# Altium schematic sheet Sheet1.SchDoc
size A3; SheetNumber: 1; SheetTotal: 1
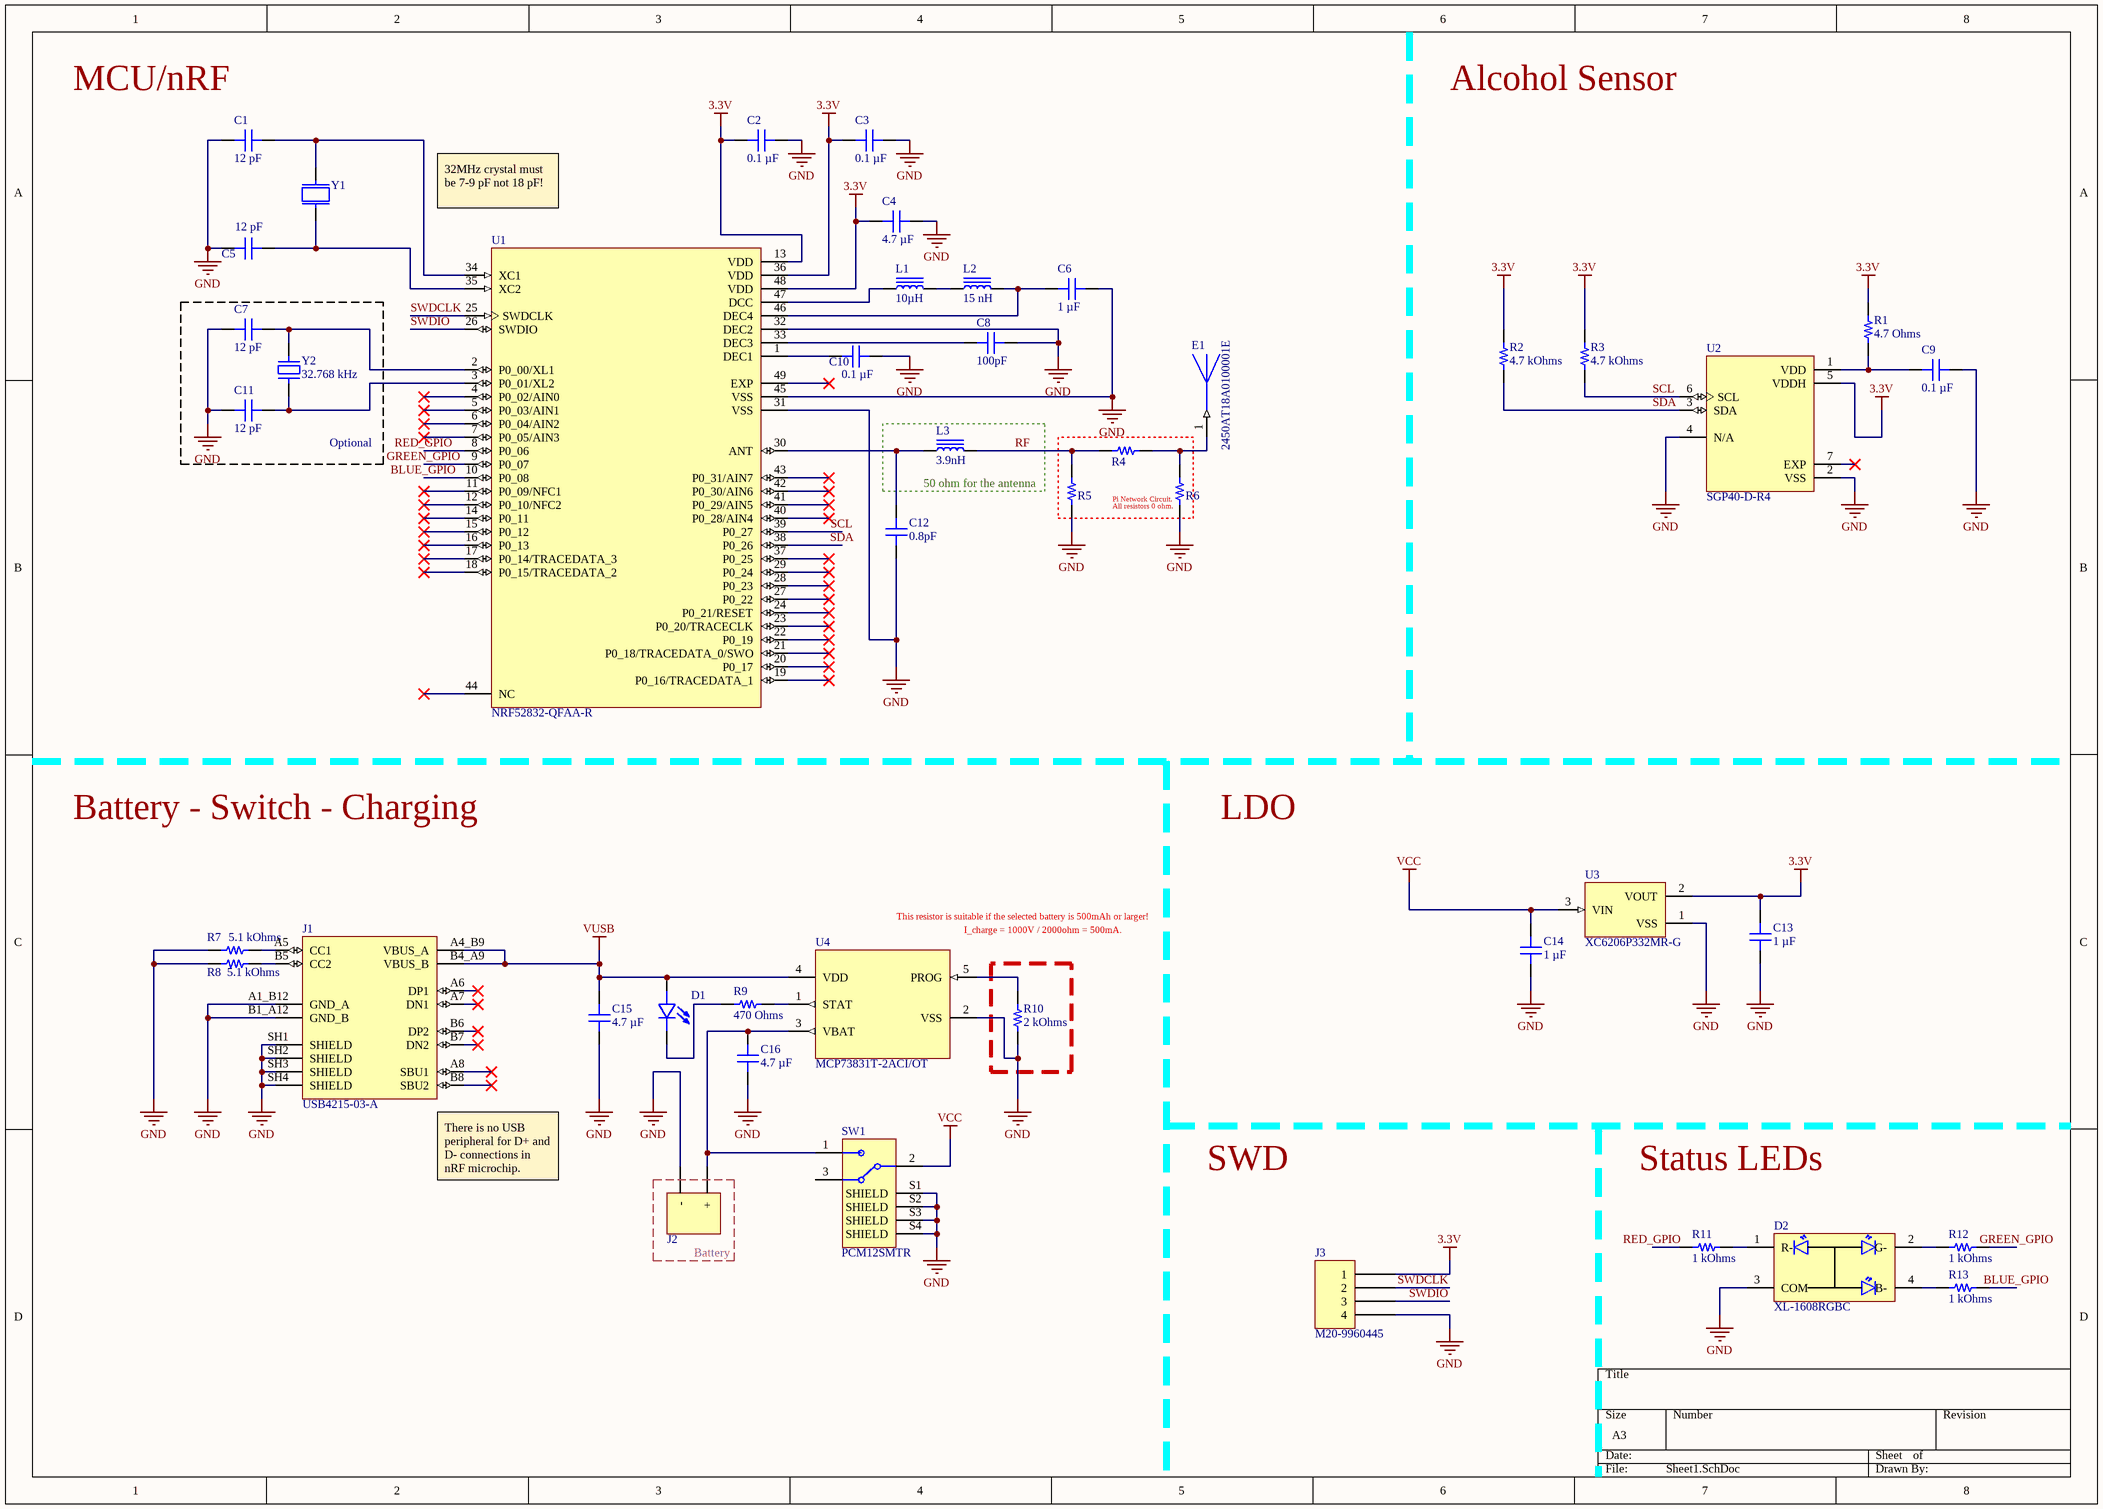
[diagram p0: Sheet1.SchDoc]

## Parts
C1  12 pF  [CAP 0402_1005]
C2  0.1 µF  [CAP 0402_1005]
C3  0.1 µF  [CAP 0402_1005]
C4  4.7 µF  [CAP 0402_1005]
C5  12 pF  [CAP 0402_1005]
C6  1 µF  [CAP 0402_1005]
C7  12 pF  [CAP 0402_1005]
C8  100pF  [CAP 0402_1005]
C9  0.1 µF  [CAP 0402_1005]
C10  0.1 µF  [CAP 0402_1005]
C11  12 pF  [CAP 0402_1005]
C12  0.8pF  [CAP 0402_1005]
C13  1 µF  [CAP 0402_1005]
C14  1 µF  [CAP 0402_1005]
C15  4.7 µF  [CAP 0402_1005]
C16  4.7 µF  [CAP 0402_1005]
D1  XZFBB53W-1  [XZFBB53W-1]  (value not drawn)
D2  XL-1608RGBC  [XL-1608RGBC]
E1  2450AT18A0100001E  [2450AT18A0100001E]
J1  USB4215-03-A  [USB4215-03-A]
J2  Male Header 2 Pin  [Male Header 2 Pin]  (value not drawn)
J3  M20-9960445  [HARWIN M20-9960445]
L1  10µH  [IND 1008_2520]
L2  15 nH  [IND 0201_0603]
L3  3.9nH  [IND 0402_1005]
R1  4.7 Ohms  [RES 0402_1005]
R2  4.7 kOhms  [RES 0402_1005]
R3  4.7 kOhms  [RES 0402_1005]
R4  (no value)  [RES 0402_1005]
R5  (no value)  [RES 0402_1005]
R6  (no value)  [RES 0402_1005]
R7  5.1 kOhms  [RES 0402_1005]
R8  5.1 kOhms  [RES 0402_1005]
R9  470 Ohms  [RES 0402_1005]
R10  2 kOhms  [RES 0402_1005]
R11  1 kOhms  [RES 0402_1005]
R12  1 kOhms  [RES 0402_1005]
R13  1 kOhms  [RES 0402_1005]
SW1  PCM12SMTR  [PCM12SMTR]
U1  NRF52832-QFAA-R  [NRF52832-QFAA-R]
U2  SGP40-D-R4  [SGP40-D-R4]
U3  XC6206P332MR-G  [SOT-23]
U4  MCP73831T-2ACI/OT  [MCP73831T-2ACI/OT]
Y1  XRCGB32M000F2P01R0  [XRCGB32M000F2P01R0]  (value not drawn)
Y2  32.768 kHz  [ABRACON ABS06]

## Blocks framed on the sheet
Optional: C7 C11 Y2
50 ohm for the antenna: L3
Battery: J2

## Nets
3.3V: C2.1 C3.1 C4.1 C13.2 J3.1 R1.2 R2.2 R3.2 U1.13(VDD) U1.36(VDD) U1.48(VDD) U2.5(VDDH) U3.2(VOUT)
GND: C1.1 C2.2 C3.2 C4.2 C5.2 C6.1 C7.1 C8.2 C9.2 C10.1 C11.1 C12.1 C13.1 C14.1 C15.1 C16.1 D2.3(COM) J1.A1_B12(GND_A) J1.B1_A12(GND_B) J1.SH1(SHIELD) J1.SH2(SHIELD) J1.SH3(SHIELD) J1.SH4(SHIELD) J2.01(-) J3.4 R5.2 R6.2 R7.1 R8.1 R10.1 SW1.S1(SHIELD) SW1.S2(SHIELD) SW1.S3(SHIELD) SW1.S4(SHIELD) U1.31(VSS) U1.32(DEC2) U1.45(VSS) U2.2(VSS) U2.4(N/A) U3.1(VSS) U4.2(VSS)
VCC: C14.2 SW1.2 U3.3(VIN)
VUSB: C15.2 D1.A J1.A4_B9(VBUS_A) J1.B4_A9(VBUS_B) U4.4(VDD)
BLUE_GPIO: R13.2 U1.10(P0_08)
GREEN_GPIO: R12.2 U1.9(P0_07)
RED_GPIO: R11.1 U1.8(P0_06)
RF: L3.2 R4.1 R5.1
SCL: R3.1 U1.39(P0_27) U2.6(SCL)
SDA: R2.1 U1.38(P0_26) U2.3(SDA)
SWDCLK: J3.2 U1.25(SWDCLK)
SWDIO: J3.3 U1.26(SWDIO)
NetC1_2: C1.2 U1.34(XC1) Y1.2
NetC5_1: C5.1 U1.35(XC2) Y1.1
NetC6_2: C6.2 L2.2 U1.46(DEC4)
NetC7_2: C7.2 U1.2(P0_00/XL1) Y2.2
NetC8_1: C8.1 U1.33(DEC3)
NetC9_1: C9.1 R1.1 U2.1(VDD)
NetC10_2: C10.2 U1.1(DEC1)
NetC11_2: C11.2 U1.3(P0_01/XL2) Y2.1
NetC12_2: C12.2 L3.1 U1.30(ANT)
NetC16_2: C16.2 J2.02(+) SW1.1 U4.3(VBAT)
NetD1_C: D1.C R9.1
NetD2_1: D2.1(R-) R11.2
NetD2_2: D2.2(G-) R12.1
NetD2_4: D2.4(B-) R13.1
NetE1_1: E1.1 R4.2 R6.1
NetJ1_A5: J1.A5(CC1) R7.2
NetJ1_B5: J1.B5(CC2) R8.2
NetL1_1: L1.1 U1.47(DCC)
NetL1_2: L1.2 L2.1
NetR9_2: R9.2 U4.1(STAT)
NetR10_2: R10.2 U4.5(PROG)

Not connected (* = marked no-connect by the designer): J1 A6(DP1)* A7(DN1)* A8(SBU1)* B6(DP2)* B7(DN2)* B8(SBU2)*; SW1 3; U1 4(P0_02/AIN0)* 5(P0_03/AIN1)* 6(P0_04/AIN2)* 7(P0_05/AIN3)* 11(P0_09/NFC1)* 12(P0_10/NFC2)* 14(P0_11)* 15(P0_12)* 16(P0_13)* 17(P0_14/TRACEDATA_3)* 18(P0_15/TRACEDATA_2)* 19(P0_16/TRACEDATA_1)* 20(P0_17)* 21(P0_18/TRACEDATA_0/SWO)* 22(P0_19)* 23(P0_20/TRACECLK)* 24(P0_21/RESET)* 27(P0_22)* 28(P0_23)* 29(P0_24)* 37(P0_25)* 40(P0_28/AIN4)* 41(P0_29/AIN5)* 42(P0_30/AIN6)* 43(P0_31/AIN7)* 44(NC)* 49(EXP)*; U2 7(EXP)*

## Notes on the sheet
- (near C1) MCU/nRF
- Alcohol Sensor
- 32MHz crystal must be 7-9 pF not 18 pF!
- (near R6) Pi Network Circuit.
- (near R6) All resistors 0 ohm.
- Battery - Switch - Charging
- LDO
- This resistor is suitable if the selected battery is 500mAh or larger!
- I_charge = 1000V / 2000ohm = 500mA.
- (near J1) There is no USB peripheral for D+ and D- connections in nRF microchip.
- SWD
- Status LEDs

## Library data of the parts
C1 C5 = CBR04C120F5GAC: CAP CER 12PF 50V C0G/NP0 0402; manufacturer: KEMET; Temperature Coefficient: C0G, NP0; Tolerance: ±1%; Part Number: CBR04C120F5GAC; Value: 12 pF; Applications: RF, Microwave, High Frequency; Capacitance: 12 pF; componentlink1description: Datasheet; componentlink1url: https://api.kemet.com/component-edge/download/datasheet/CBR04C120F5GAC.pdf; componentlink2description: DigiKey Link; componentlink2url: https://www.digikey.com/en/products/detail/kemet/CBR04C120F5GAC/3479654; Device Package: 0402 (1005 Metric); Features: High Q, Low Loss, Ultra Low ESR; lastupdated: 9.02.2024 20:04:38; Lifecycle Status: Active; Minimum Order: 1; Mounting Type: Surface Mount, MLCC; Operating Temperature: -55°C ~ 125°C; Package / Case: 0402 (1005 Metric); packaging: TapeAndReel; partid: 1750; Part Status: Active; price: 0.06; series: CBR-SMD RF C0G; Size / Dimension: 0.039" L x 0.020" W (1.00mm x 0.50mm); Supplier 1: DigiKey; Supplier Part Number 1: 399-8815-1-ND; Thickness (Max): 0.022" (0.55mm); Voltage - Rated: 50V
C2 C3 C9 C10 = CL05B104KP5VPNC: CAP CER 100NF 10V X7R 0402; manufacturer: Samsung Electro-Mechanics; Tolerance: ±10%; Part Number: CL05B104KP5VPNC; Value: 0.1 µF; Applications: Automotive; Capacitance: 0.1 µF; componentlink1description: Datasheet; componentlink1url: https://mm.digikey.com/Volume0/opasdata/d220001/medias/docus/5458/CL05B104KP5VPNC_Spec.pdf; componentlink2description: DigiKey Link; componentlink2url: https://www.digikey.com/en/products/detail/samsung-electro-mechanics/CL05B104KP5VPNC/20498482; Device Package: 0402 (1005 Metric); lastupdated: 9.02.2024 20:03:17; Lifecycle Status: Active; Minimum Order: 1; Mounting Type: Surface Mount, MLCC; Operating Temperature: -55°C ~ 125°C; Package / Case: 0402 (1005 Metric); packaging: TapeAndReel; partid: 56690; price: 0.01; Ratings: AEC-Q200; series: CL; Size / Dimension: 0.039" L x 0.020" W (1.00mm x 0.50mm); Supplier 1: DigiKey; Supplier Part Number 1: 1276-CL05B104KP5VPNCCT-ND; Temperature Coefficient: X7R; Thickness (Max): 0.022" (0.55mm); Voltage - Rated: 10V
C4 C15 C16 = CL05A475MO5NUNC: CAP CER 4.7UF 16V X5R 0402; manufacturer: Samsung Electro-Mechanics; Tolerance: ±20%; Part Number: CL05A475MO5NUNC; Value: 4.7 µF; Applications: General Purpose; Capacitance: 4.7 µF; componentlink1description: Datasheet; componentlink1url: http://www.samsungsem.com/kr/support/product-search/mlcc/__icsFiles/afieldfile/2019/05/29/Data%20sheet_CL05A475MO5NUNC.pdf; componentlink2description: DigiKey Link; componentlink2url: https://www.digikey.com/en/products/detail/samsung-electro-mechanics/CL05A475MO5NUNC/5961320; Device Package: 0402 (1005 Metric); lastupdated: 9.02.2024 20:04:38; Lifecycle Status: Active; Minimum Order: 1; Mounting Type: Surface Mount, MLCC; Operating Temperature: -55°C ~ 85°C; Package / Case: 0402 (1005 Metric); packaging: TapeAndReel; partid: 1760; Part Status: Active; price: 0.08; series: CL; Size / Dimension: 0.039" L x 0.020" W (1.00mm x 0.50mm); Supplier 1: DigiKey; Supplier Part Number 1: 1276-6836-1-ND; Temperature Coefficient: X5R; Thickness (Max): 0.028" (0.70mm); Voltage - Rated: 16V
C6 C13 C14 = 885012105012: CAP CER 1UF 10V X5R 0402; manufacturer: Würth Elektronik; Tolerance: ±20%; Part Number: 885012105012; Value: 1 µF; Applications: General Purpose; Capacitance: 1 µF; componentlink1description: Datasheet; componentlink1url: https://katalog.we-online.de/pbs/datasheet/885012105012.pdf; componentlink2description: DigiKey Link; componentlink2url: https://www.digikey.com/en/products/detail/würth-elektronik/885012105012/5453344; Device Package: 0402 (1005 Metric); lastupdated: 9.02.2024 20:04:38; Lifecycle Status: Active; Minimum Order: 1; Mounting Type: Surface Mount, MLCC; Operating Temperature: -55°C ~ 85°C; Package / Case: 0402 (1005 Metric); packaging: TapeAndReel; partid: 1807; Part Status: Active; price: 0.16; series: WCAP-CSGP; Size / Dimension: 0.039" L x 0.020" W (1.00mm x 0.50mm); Supplier 1: DigiKey; Supplier Part Number 1: 732-7489-1-ND; Temperature Coefficient: X5R; Thickness (Max): 0.022" (0.55mm); Voltage - Rated: 10V
C7 C11 = C0402C120J3GAC7867: CAP CER 12PF 25V NP0 0402; manufacturer: KEMET; Temperature Coefficient: C0G, NP0; Tolerance: ±5%; Part Number: C0402C120J3GAC7867; Value: 12 pF; Applications: General Purpose; Capacitance: 12 pF; componentlink1description: Datasheet; componentlink1url: https://api.kemet.com/component-edge/download/datasheet/C0402C120J3GACTU.pdf; componentlink2description: DigiKey Link; componentlink2url: https://www.digikey.com/en/products/detail/kemet/C0402C120J3GAC7867/2196267; Device Package: 0402 (1005 Metric); Features: Low ESL; lastupdated: 9.02.2024 20:04:32; Lifecycle Status: Active; Minimum Order: 1; Mounting Type: Surface Mount, MLCC; Operating Temperature: -55°C ~ 125°C; Package / Case: 0402 (1005 Metric); packaging: TapeAndReel; partid: 5422; Part Status: Active; price: 0.04; series: SMD Comm C0G; Size / Dimension: 0.039" L x 0.020" W (1.00mm x 0.50mm); Supplier 1: DigiKey; Supplier Part Number 1: 399-15295-1-ND; Thickness (Max): 0.022" (0.55mm); Voltage - Rated: 25V
C8 = 0402ZC101MAT2A: CAP CER 100PF 10V X7R 0402; manufacturer: AVX Corporation; Tolerance: ±20%; Part Number: 0402ZC101MAT2A; Value: 100pF; Applications: General Purpose; Capacitance: 100pF; componentlink1description: Datasheet; componentlink1url: http://datasheets.avx.com/X7RDielectric.pdf; componentlink2description: DigiKey Link; componentlink2url: http://digikey.com/product-detail/en/avx-corporation/0402ZC101MAT2A/478-11786-1-ND/8573422; Device Package: 0402 (1005 Metric); lastupdated: 8.02.2022 12:26:58; Lifecycle Status: Active; Minimum Order: 1; Mounting Type: Surface Mount, MLCC; Operating Temperature: -55°C ~ 125°C; Package / Case: 0402 (1005 Metric); packaging: TapeAndReel; partid: 1986; Part Status: Active; price: 0.05; series: -; Size / Dimension: 0.039" L x 0.020" W (1.00mm x 0.50mm); Supplier 1: DigiKey; Supplier Part Number 1: 478-11786-1-ND; Temperature Coefficient: X7R; Thickness (Max): 0.022" (0.56mm); Voltage - Rated: 10V
C12 = 04025A0R8BAT2A: CAP CER 0.8PF 50V NP0 0402; manufacturer: AVX Corporation; Temperature Coefficient: C0G, NP0; Tolerance: ±0.1pF; Part Number: 04025A0R8BAT2A; Value: 0.8pF; Applications: General Purpose; Capacitance: 0.8pF; componentlink1description: Datasheet; componentlink1url: http://datasheets.avx.com/C0GNP0-Dielectric.pdf; componentlink2description: DigiKey Link; componentlink2url: http://digikey.com/product-detail/en/avx-corporation/04025A0R8BAT2A/478-11760-1-ND/8573396; Device Package: 0402 (1005 Metric); lastupdated: 8.02.2022 12:26:50; Lifecycle Status: Active; Minimum Order: 1; Mounting Type: Surface Mount, MLCC; Operating Temperature: -55°C ~ 125°C; Package / Case: 0402 (1005 Metric); packaging: TapeAndReel; partid: 7022; Part Status: Active; price: 0.06; series: -; Size / Dimension: 0.039" L x 0.020" W (1.00mm x 0.50mm); Supplier 1: DigiKey; Supplier Part Number 1: 478-11760-1-ND; Thickness (Max): 0.022" (0.55mm); Voltage - Rated: 50V
D1 = XZFBB53W-1: 1.6X0.8MM BLUE SMD 0603 LED
D2 = XL-1608RGBC: Red, Green, Blue (RGB) 625nm Red, 525nm Green, 470nm Blue LED Indication - Discrete 2.1V Red, 3.1V Green, 3.1V Blue 0603 (1608 Metric)
E1 = 2450AT18A0100001E: 2.4GHz Chip RF Antenna 2.4GHz ~ 2.5GHz 0.5dBi Solder Surface Mount
J1 = USB4215-03-A: USB-C (USB TYPE-C) USB 2.0 Receptacle Connector 24 (16+8 Dummy) Position Surface Mount, Right Angle; Through Hole
J3 = M20-9960445: CONN HEADER R/A 4POS 2.54MM; Manufacturer: Harwin Inc.; Connector Type: Header, Cuttable; Contact Length - Mating: 0.240" (6.10mm); Contact Length - Post: 0.118" (3.00mm); Current Rating (Amps): 3A per Contact; Material Flammability Rating: UL94 V-0; Number of Positions: 4; Number of Positions Loaded: All; Pitch - Mating: 0.100" (2.54mm); Row Spacing - Mating: -40°C ~ 105°C; Shrouding: Unshrouded; Style: Board to Board or Cable; Part Number: M20-9960445; ComponentLink1Description: Datasheet; ComponentLink1URL: https://cdn.harwin.com/pdfs/Harwin_PC_Connectors_M20.pdf; ComponentLink2Description: DigiKey Link; ComponentLink2URL: https://www.digikey.com/en/products/detail/harwin-inc/M20-9960445/3921052; Contact Finish - Mating: Gold; Contact Material: Brass; Contact Shape: Square; Contact Type: Male Pin; Fastening Type: Push-Pull; Insulation Color: Black; Insulation Height: 0.100" (2.54mm); Insulation Material: Polyamide (PA6T), Nylon 6T; LastUpdated: 21.09.2022 19:23:20; Lifecycle Status: Active; Minimum Order: 1; Mounting Type: Through Hole, Right Angle; Number of Rows: 1; Operating Temperature: -40°C ~ 105°C; Packaging: Bulk; PartId: 167; Part Status: Active; Price: 0.11; Series: M20; Supplier 1: DigiKey; Supplier Part Number 1: 952-3286-ND; Termination: Solder
L1 = 74479887310A: FIXED IND 10UH 850MA 300 MOHM; Manufacturer: Würth Elektronik; Current - Saturation: 125mA; Frequency - Self Resonant: 20MHz; Inductance Frequency - Test: 1MHz; Material - Core: 1008 (2520 Metric); Q @ Freq: 27 @ 1MHz; Shielding: Shielded; Tolerance: ±20%; Type: Multilayer; Part Number: 74479887310A; ComponentLink1Description: Datasheet; ComponentLink1URL: https://katalog.we-online.de/pbs/datasheet/74479887310A.pdf; ComponentLink2Description: DigiKey Link; ComponentLink2URL: http://digikey.com/product-detail/en/w-rth-elektronik/74479887310A/732-4516-1-ND/4120134; Current Rating (Amps): 850mA; DC Resistance (DCR): 300mOhm; Device Package: 1008 (2520 Metric); Height - Seated (Max): 0.039" (1.00mm); Inductance: 10µH; LastUpdated: 2.09.2020 01:29:35; Lifecycle Status: Active; Minimum Order: 1; Mounting Type: Surface Mount; Operating Temperature: -40°C ~ 125°C; Package / Case: 1008 (2520 Metric); Packaging: TapeAndReel; PartId: 3502; Part Status: Active; Price: 0.80; Series: WE-PMI; Size / Dimension: 0.098" L x 0.079" W (2.50mm x 2.00mm); Supplier 1: DigiKey; Supplier Part Number 1: 732-4516-1-ND; Supplier Device Package: 1008 (2520 Metric); Value: 10µH
L2 = LQP03HQ15NJ02D: FIXED IND 15NH 300MA 700MOHM SMD; Manufacturer: Murata Electronics; DC Resistance (DCR): 700mOhm Max; Frequency - Self Resonant: 3.5GHz; Inductance Frequency - Test: 500 MHz; Material - Core: Non-Magnetic; Q @ Freq: 20 @ 500MHz; Shielding: Unshielded; Tolerance: ±5%; Type: Thick Film; Part Number: LQP03HQ15NJ02D; ComponentLink1Description: Datasheet; ComponentLink1URL: https://search.murata.co.jp/Ceramy/image/img/P02/JELF243C-0021.pdf; ComponentLink2Description: DigiKey Link; ComponentLink2URL: https://www.digikey.com/en/products/detail/murata-electronics/LQP03HQ15NJ02D/6098663; Current Rating (Amps): 300 mA; Device Package: 0201 (0603 Metric); Height - Seated (Max): 0.017" (0.42mm); Inductance: 15 nH; LastUpdated: 3.06.2024 20:08:37; Lifecycle Status: Active; Minimum Order: 1; Mounting Type: Surface Mount; Operating Temperature: -55°C ~ 125°C; Package / Case: 0201 (0603 Metric); Packaging: TapeAndReel; PartId: 492; Part Status: Active; Price: 0.04; Series: LQP03; Size / Dimension: 0.024" L x 0.012" W (0.60mm x 0.30mm); Supplier 1: DigiKey; Supplier Part Number 1: 490-13863-1-ND; Supplier Device Package: 0201 (0603 Metric); Value: 15 nH
L3 = BSCH001005053N9SCP: RF INDUCTOR ML; Manufacturer: Chilisin Electronics; Current Rating (Amps): 400mA; DC Resistance (DCR): 180mOhm Max; Frequency - Self Resonant: 6.1GHz; Inductance Frequency - Test: 100MHz; Material - Core: Ceramic; Q @ Freq: 8 @ 100MHz; Shielding: Unshielded; Tolerance: ±0.3nH; Type: Multilayer; Part Number: BSCH001005053N9SCP; ComponentLink1Description: Datasheet; ComponentLink1URL: https://www.chilisin.com/upload/media/product/rf/file/BSCH_Series.pdf; ComponentLink2Description: DigiKey Link; ComponentLink2URL: http://digikey.com/product-detail/en/chilisin-electronics/BSCH001005053N9SCP/2184-BSCH001005053N9SCPCT-ND/10509199; Device Package: 0402 (1005 Metric); Inductance: 3.9nH; LastUpdated: 3.06.2024 20:13:02; Lifecycle Status: Active; Minimum Order: 1; Mounting Type: Surface Mount; Operating Temperature: -55°C ~ 125°C; Package / Case: 0402 (1005 Metric); Packaging: Unknown; PartId: 3340; Part Status: Active; Price: 0.01; Series: BSCH; Supplier 1: DigiKey; Supplier Part Number 1: 2184-BSCH001005053N9SCPCT-ND; Supplier Device Package: 0402; Value: 3.9nH
R1 = CRCW04024R70JNED: RES SMD 4.7 OHM 5% 1/16W 0402; Manufacturer: Vishay Dale; Power (Watts): 0.063W, 1/16W; Temperature Coefficient: ±200ppm/°C; Part Number: CRCW04024R70JNED; Value: 4.7 Ohms; ComponentLink1Description: Datasheet; ComponentLink1URL: http://www.vishay.com/docs/20035/dcrcwe3.pdf; ComponentLink2Description: DigiKey Link; ComponentLink2URL: https://www.digikey.com/en/products/detail/vishay-dale/CRCW04024R70JNED/1177512; Composition: Thick Film; Device Package: 0402 (1005 Metric); Features: Automotive AEC-Q200; Height - Seated (Max): 0.016" (0.40mm); LastUpdated: 9.02.2024 20:30:14; Lifecycle Status: Active; Minimum Order: 1; Number of Terminations: 2; Operating Temperature: -55°C ~ 155°C; Package / Case: 0402 (1005 Metric); Packaging: CutTape; PartId: 4704; Part Status: Active; Price: 0.01; Ratings: AEC-Q200; Resistance: 4.7 Ohms; Series: CRCW; Size / Dimension: 0.039" L x 0.020" W (1.00mm x 0.50mm); Supplier 1: DigiKey; Supplier Part Number 1: 541-4.7JCT-ND; Supplier Device Package: 0402; Tolerance: ±5%
R2 R3 = RR0510P-472-D: RES SMD 4.7K OHM 0.5% 1/16W 0402; Manufacturer: Susumu; Power (Watts): 0.063W, 1/16W; Temperature Coefficient: ±25ppm/°C; Part Number: RR0510P-472-D; Value: 4.7 kOhms; ComponentLink1Description: Datasheet; ComponentLink1URL: http://www.susumu.co.jp/common/pdf/n_catalog_partition05_en.pdf; ComponentLink2Description: DigiKey Link; ComponentLink2URL: https://www.digikey.com/en/products/detail/susumu/RR0510P-472-D/432413; Composition: Thin Film; Device Package: 0402 (1005 Metric); Height - Seated (Max): 0.016" (0.40mm); LastUpdated: 9.02.2024 20:30:21; Lifecycle Status: Active; Minimum Order: 1; Number of Terminations: 2; Operating Temperature: -55°C ~ 125°C; Package / Case: 0402 (1005 Metric); Packaging: TapeAndReel; PartId: 3209; Part Status: Active; Price: 0.01; Resistance: 4.7 kOhms; Series: RR; Size / Dimension: 0.039" L x 0.020" W (1.00mm x 0.50mm); Supplier 1: DigiKey; Supplier Part Number 1: RR05P4.7KDCT-ND; Tolerance: ±0.5%
R4-R6 = MCS04020Z0000ZE000: RES SMD 0 OHM JUMPER 1/10W 0402; Manufacturer: Vishay Beyschlag; Power (Watts): 0.1W, 1/10W; Part Number: MCS04020Z0000ZE000; ComponentLink1Description: Datasheet; ComponentLink1URL: http://www.vishay.com/docs/28705/mcx0x0xpro.pdf; ComponentLink2Description: DigiKey Link; ComponentLink2URL: http://digikey.com/product-detail/en/vishay-beyschlag/MCS04020Z0000ZE000/MCS0402-0.0-ZZCT-ND/2607873; Composition: Thin Film; Device Package: 0402 (1005 Metric); Features: Anti-Sulfur; Height - Seated (Max): 0.015" (0.37mm); LastUpdated: 14.02.2022 15:04:19; Lifecycle Status: Active; Minimum Order: 1; Number of Terminations: 2; Operating Temperature: -55°C ~ 155°C; Package / Case: 0402 (1005 Metric); Packaging: TapeAndReel; PartId: 3160; Part Status: Active; Price: 0.03; Series: MCS - Professional; Size / Dimension: 0.039" L x 0.020" W (1.00mm x 0.50mm); Supplier 1: DigiKey; Supplier Part Number 1: MCS0402-0.0-ZZCT-ND; Supplier Device Package: 0402; Tolerance: Jumper
R7 R8 = ERA-2AEB512X: RES SMD 5.1K OHM 0.1% 1/16W 0402; Manufacturer: Panasonic Electronic Components; Power (Watts): 0.063W, 1/16W; Temperature Coefficient: ±25ppm/°C; Part Number: ERA-2AEB512X; Value: 5.1 kOhms; ComponentLink1Description: Datasheet; ComponentLink1URL: https://industrial.panasonic.com/cdbs/www-data/pdf/RDM0000/AOA0000C307.pdf; ComponentLink2Description: DigiKey Link; ComponentLink2URL: https://www.digikey.com/en/products/detail/panasonic-electronic-components/ERA-2AEB512X/1706022; Composition: Thin Film; Device Package: 0402 (1005 Metric); Features: Automotive AEC-Q200; Height - Seated (Max): 0.016" (0.40mm); LastUpdated: 9.02.2024 20:30:08; Lifecycle Status: Active; Minimum Order: 1; Number of Terminations: 2; Operating Temperature: -55°C ~ 155°C; Package / Case: 0402 (1005 Metric); Packaging: TapeAndReel; PartId: 6135; Part Status: Active; Price: 0.04; Ratings: AEC-Q200; Resistance: 5.1 kOhms; Series: ERA-2A; Size / Dimension: 0.039" L x 0.020" W (1.00mm x 0.50mm); Supplier 1: DigiKey; Supplier Part Number 1: P5.1KDCCT-ND; Supplier Device Package: 0402; Tolerance: ±0.1%
R9 = TNPW0402470RBYEP: RES 470 OHM 0.1% 1/16W 0402; Manufacturer: Vishay Dale; Power (Watts): 0.1W, 1/10W; Temperature Coefficient: ±10ppm/°C; Part Number: TNPW0402470RBYEP; Value: 470 Ohms; ComponentLink1Description: Datasheet; ComponentLink1URL: http://www.vishay.com/docs/28758/tnpw_e3.pdf; ComponentLink2Description: DigiKey Link; ComponentLink2URL: http://digikey.com/product-detail/en/vishay-dale/TNPW0402470RBYEP/541-9810-1-ND/9562435; Composition: Thin Film; Device Package: 0402 (1005 Metric); Features: Anti-Sulfur, Automotive AEC-Q200, Moisture Resistant; Height - Seated (Max): 0.016" (0.40mm); LastUpdated: 9.02.2024 20:30:21; Lifecycle Status: Active; Minimum Order: 1; Number of Terminations: 2; Operating Temperature: -55°C ~ 155°C; Package / Case: 0402 (1005 Metric); Packaging: TapeAndReel; PartId: 3068; Part Status: Active; Price: 0.27; Ratings: AEC-Q200; Resistance: 470 Ohms; Series: TNPW e3; Size / Dimension: 0.039" L x 0.020" W (1.00mm x 0.50mm); Supplier 1: DigiKey; Supplier Part Number 1: 541-9810-1-ND; Supplier Device Package: 0402; Tolerance: ±0.1%
R10 = CPF0402B2K0E1: RES SMD 2K OHM 0.1% 1/16W 0402; Manufacturer: TE Connectivity Passive Product; Power (Watts): 0.063W, 1/16W; Temperature Coefficient: ±25ppm/°C; Part Number: CPF0402B2K0E1; Value: 2 kOhms; ComponentLink1Description: Datasheet; ComponentLink1URL: https://www.te.com/commerce/DocumentDelivery/DDEController?Action=srchrtrv&DocNm=1773200&DocType=DS&DocLang=English; ComponentLink2Description: DigiKey Link; ComponentLink2URL: https://www.digikey.com/en/products/detail/te-connectivity-passive-product/CPF0402B2K0E1/2381811; Composition: Thin Film; Device Package: 0402 (1005 Metric); Height - Seated (Max): 0.014" (0.35mm); LastUpdated: 9.02.2024 20:30:20; Lifecycle Status: Active; Minimum Order: 1; Number of Terminations: 2; Operating Temperature: -55°C ~ 155°C; Package / Case: 0402 (1005 Metric); Packaging: TapeAndReel; PartId: 3338; Part Status: Active; Price: 0.13; Resistance: 2 kOhms; Series: CPF, Neohm; Size / Dimension: 0.039" L x 0.020" W (1.00mm x 0.50mm); Supplier 1: DigiKey; Supplier Part Number 1: A102762CT-ND; Supplier Device Package: 0402; Tolerance: ±0.1%
R11-R13 = CPF0402B1K0E: RES SMD 1K OHM 0.1% 1/16W 0402; Manufacturer: TE Connectivity Passive Product; Power (Watts): 0.063W, 1/16W; Temperature Coefficient: ±25ppm/°C; Part Number: CPF0402B1K0E; Value: 1 kOhms; ComponentLink1Description: Datasheet; ComponentLink1URL: https://www.te.com/commerce/DocumentDelivery/DDEController?Action=srchrtrv&DocNm=1773200&DocType=DS&DocLang=English; ComponentLink2Description: DigiKey Link; ComponentLink2URL: https://www.digikey.com/en/products/detail/te-connectivity-passive-product/CPF0402B1K0E/4966468; Composition: Thin Film; Device Package: 0402 (1005 Metric); Height - Seated (Max): 0.014" (0.35mm); LastUpdated: 9.02.2024 20:30:24; Lifecycle Status: Active; Minimum Order: 1; Number of Terminations: 2; Operating Temperature: -55°C ~ 155°C; Package / Case: 0402 (1005 Metric); Packaging: TapeAndReel; PartId: 2470; Part Status: Active; Price: 0.10; Resistance: 1 kOhms; Series: CPF, Neohm; Size / Dimension: 0.039" L x 0.020" W (1.00mm x 0.50mm); Supplier 1: DigiKey; Supplier Part Number 1: A119928CT-ND; Supplier Device Package: 0402; Tolerance: ±0.1%
SW1 = PCM12SMTR: Slide Switch SPDT Surface Mount, Right Angle
U1 = NRF52832-QFAA-R: IC RF TxRx + MCU Bluetooth, General ISM > 1GHz ANT, Bluetooth v5.0 2.4GHz 48-VFQFN Exposed Pad
U2 = SGP40-D-R4: MOx based gas sensor for indoor air quality applications
U3 = XC6206P332MR-G: Linear Voltage Regulator IC Positive Fixed 1 Output 200mA SOT-23
U4 = MCP73831T-2ACI/OT: Charger IC Lithium Ion/Polymer SOT-23-5
Y1 = XRCGB32M000F2P01R0: 32 MHz ±20ppm Crystal 8pF 100 Ohms 4-SMD, No Lead
Y2 = ABS06-32.768KHZ-1-T: CRYSTAL 32.7680KHZ 12.5PF SMD; Manufacturer: Abracon LLC; ESR (Equivalent Series Resistance): 90 kOhms; Frequency Tolerance: ±10ppm; Operating Mode: Fundamental; Part Number: ABS06-32.768KHZ-1-T; ComponentLink1Description: Datasheet; ComponentLink1URL: https://abracon.com/Resonators/ABS06.pdf; ComponentLink2Description: DigiKey Link; ComponentLink2URL: https://www.digikey.com/en/products/detail/abracon-llc/ABS06-32-768KHZ-1-T/2217994; Frequency: 32.768 kHz; Height - Seated (Max): 0.024" (0.60mm); LastUpdated: 3.06.2024 20:02:03; Lifecycle Status: Active; Load Capacitance: 12.5pF; Minimum Order: 1; Mounting Type: Surface Mount; Operating Temperature: -40°C ~ 85°C; Package / Case: 2-SMD, No Lead; Packaging: TapeAndReel; PartId: 370; Part Status: Active; Price: 0.33; Series: ABS06; Size / Dimension: 0.079" L x 0.047" W (2.00mm x 1.20mm); Supplier 1: DigiKey; Supplier Part Number 1: 535-10248-1-ND; Type: kHz Crystal (Tuning Fork); Value: 32.768 kHz